# Altium schematic sheet Power.SchDoc
size A; SheetNumber: 4; SheetTotal: 6
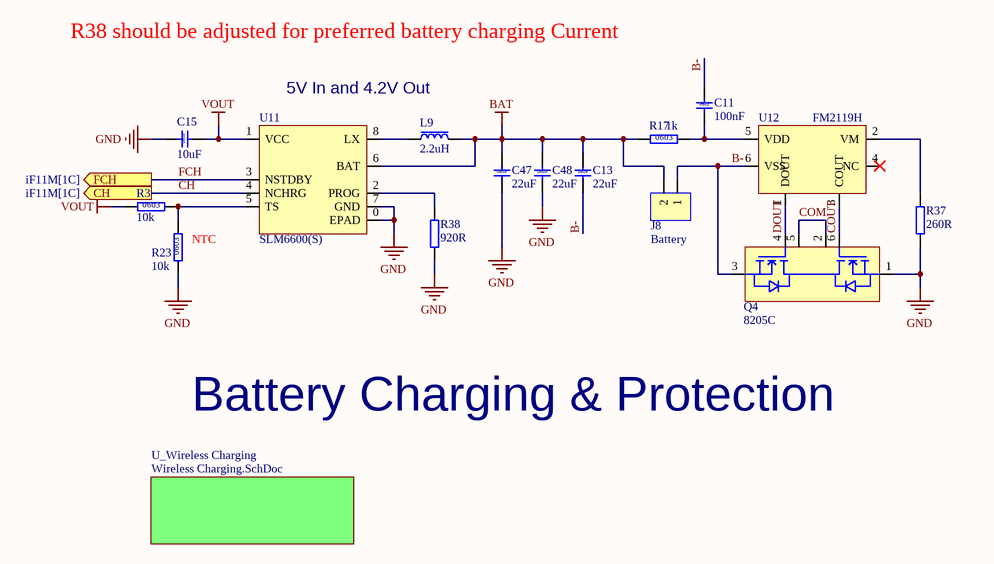
[diagram p0: Power.SchDoc]

## Parts
C11  100nF  [C0603]
C13  22uF  [C0805]
C15  10uF  [C0805]
C47  22uF  [C0805]
C48  22uF  [C0805]
J8  Battery  [B2B-PH-2mm]
L9  2.2uH  [CD54]
Q4  8205C  [SOT23-6]
R3  10k  [R0603-LD]
R17  1k  [R0603-LD]
R23  10k  [R0603-LD]
R37  260R  [R0603]
R38  920R  [R0603]
U11  SLM6600(S)  [SOP-8 - EPAD]
U12  FM2119H  [SOT23-6]

## Sub-sheets
U_Wireless Charging = Wireless Charging.SchDoc: no entries

## Ports
CH (out, see iF11M[1C]), FCH (out, see iF11M[1C])

## Nets
BAT: C13.1 C47.1 C48.1 J8.2 L9.2 R17.1 U11.6(BAT)
GND: C15.1 C47.2 C48.2 Q4.1(S1) R23.1 R37.1 R38.1 U11.0(EPAD) U11.7(GND)
VOUT: C15.2 R3.1 U11.1(VCC)
B-: C11.1 C13.2 J8.1 Q4.3(S2) U12.6(VSS)
CH: U11.4(NCHRG) ; port CH
COM: Q4.2(D1) Q4.5(D2)
COUT: Q4.6(G1) U12.3(COUT)
DOUT: Q4.4(G2) U12.1(DOUT)
FCH: U11.3(NSTDBY) ; port FCH
NetC11_2: C11.2 R17.2 U12.5(VDD)
NetL9_1: L9.1 U11.8(LX)
NetR3_2: R3.2 R23.2 U11.5(TS)
NetR37_2: R37.2 U12.2(VM)
NetR38_2: R38.2 U11.2(PROG)

Not connected (* = marked no-connect by the designer): U12 4(NC)*

## Notes on the sheet
- R38 should be adjusted for preferred battery charging Current
- 5V In and 4.2V Out
- (near R23) NTC
- Battery Charging & Protection
- (in symbol C 0603 100nF 50V) 0603
- (in symbol C 0805 10uF 25V) 0805
- (in symbol C 0805 22uF 16V) 0805
- (in symbol R 0603 1k) 0603
- (in symbol R 0603 10k) 0603

## Library data of the parts
C11 = C 0603 100nF 50V: 10% 50V; Part No: W-T-CA-X703N100K50VNT; Manufacturer: FENGHUA; Material Name: 贴片电容0603 100NF/50V 10%; Product Code: WP0002721; Supplier: 南京南山半导体有限公司
C13 C47 C48 = C 0805 22uF 16V: 10% 16V; Part No: WP0005367; Material Name: 贴片电容0805 22UF/16V 10%; Product Code: WP0005367; Supplier: 深圳市四叶电子有限公司; Manufacturer: *
C15 = C 0805 10uF 25V: 10% 25V; Part No: WP0005368; Material Name: 贴片电容0805 10UF/25V 10%; Product Code: WP0005368; Supplier: 深圳市四叶电子有限公司; Manufacturer: *
J8 = B2B-PH-2MM: B2B PH 1X2 2 Pin B2B Connector
L9 = CD54: SMD Inductor 2.2 uH CD54
Q4 = JST8205S: 20V N-channel enhancement MOS field effect transistor
R3 R23 = R 0603 10k: 5%; Part No: W-T-RE-RS03K103JT; Manufacturer: 热敏D541V11增加1颗用量; Material Name: 贴片电阻0603 10K 5%; Product Code: WP0002708; Supplier: 南京南山半导体有限公司
R17 = R 0603 1k: 5%; Part No: W-T-RE-RS03K102JT; Manufacturer: LAGEO; Material Name: 贴片电阻0603 1K  5%; Product Code: WP0002703; Supplier: 南京南山半导体有限公司
R37 R38 = Resistor: Part No: *; Product Code: *; Suppliers: 南京南山半导体有限公司; Manufacturer: *